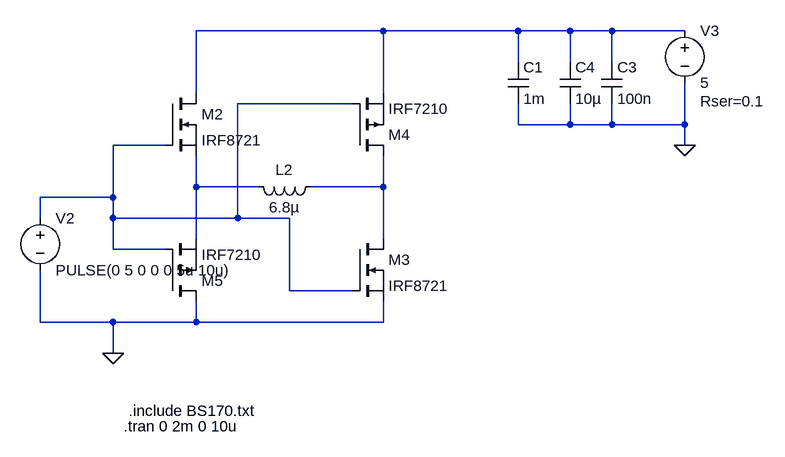
[diagram p0: schematic PowerTransmitter-Hbr.asc]
PowerTransmitter-Hbr.asc, the LTspice schematic file:
Version 4
SHEET 1 1344 1408
WIRE 608 496 320 496
WIRE 816 496 608 496
WIRE 896 496 816 496
WIRE 960 496 896 496
WIRE 1072 496 960 496
WIRE 816 544 816 496
WIRE 896 544 896 496
WIRE 960 544 960 496
WIRE 320 592 320 496
WIRE 608 592 608 496
WIRE 560 608 384 608
WIRE 816 640 816 608
WIRE 896 640 896 608
WIRE 896 640 816 640
WIRE 960 640 960 608
WIRE 960 640 896 640
WIRE 1072 640 1072 576
WIRE 1072 640 960 640
WIRE 272 672 192 672
WIRE 1072 672 1072 640
WIRE 320 736 320 688
WIRE 416 736 320 736
WIRE 608 736 608 688
WIRE 608 736 496 736
WIRE 192 752 192 672
WIRE 192 752 80 752
WIRE 80 784 80 752
WIRE 192 784 192 752
WIRE 384 784 384 608
WIRE 384 784 192 784
WIRE 464 784 384 784
WIRE 320 816 320 736
WIRE 608 816 608 736
WIRE 192 832 192 784
WIRE 272 832 192 832
WIRE 464 896 464 784
WIRE 560 896 464 896
WIRE 80 944 80 864
WIRE 192 944 80 944
WIRE 320 944 320 912
WIRE 320 944 192 944
WIRE 608 944 608 912
WIRE 608 944 320 944
WIRE 192 992 192 944
FLAG 1072 672 0
FLAG 192 992 0
SYMBOL ind 512 720 R90
WINDOW 0 5 56 VBottom 2
WINDOW 3 32 56 VTop 2
SYMATTR InstName L2
SYMATTR Value 6.8µ
SYMATTR SpiceLine Rser=10
SYMBOL nmos 272 592 R0
SYMATTR InstName M2
SYMATTR Value IRF8721
SYMBOL nmos 560 816 R0
SYMATTR InstName M3
SYMATTR Value IRF8721
SYMBOL voltage 80 768 R0
WINDOW 123 0 0 Left 0
WINDOW 39 0 0 Left 0
SYMATTR InstName V2
SYMATTR Value PULSE(0 5 0 0 0 5u 10u)
SYMBOL voltage 1072 480 R0
WINDOW 123 0 0 Left 0
WINDOW 39 24 124 Left 2
SYMATTR SpiceLine Rser=0.1
SYMATTR InstName V3
SYMATTR Value 5
SYMBOL pmos 560 688 M180
SYMATTR InstName M4
SYMATTR Value IRF7210
SYMBOL pmos 272 912 M180
SYMATTR InstName M5
SYMATTR Value IRF7210
SYMBOL cap 944 544 R0
SYMATTR InstName C3
SYMATTR Value 100n
SYMBOL cap 880 544 R0
SYMATTR InstName C4
SYMATTR Value 10µ
SYMBOL cap 800 544 R0
SYMATTR InstName C1
SYMATTR Value 1m
TEXT 216 1080 Left 2 !.include BS170.txt
TEXT 208 1104 Left 2 !.tran 0 2m 0 10u

The netlist it stands for:
* PowerTransmitter-Hbr.asc
L2 N004 N003 6.8µ Rser=10
M2 N001 N002 N003 N003 IRF8721
M3 N004 N002 0 0 IRF8721
V2 N002 0 PULSE(0 5 0 0 0 5u 10u)
V3 N001 0 5 Rser=0.1
M4 N004 N002 N001 N001 IRF7210
M5 0 N002 N003 N003 IRF7210
C3 N001 0 100n
C4 N001 0 10µ
C1 N001 0 1m
.model NMOS NMOS
.model PMOS PMOS
.lib standard.mos
.include BS170.txt
.tran 0 2m 0 10u
.backanno
.end